# EasyEDA Pro project 按键点灯.eprj

# Schematic Schematic1
Board Name: Board1; Create Date: 2024-12-21; Page Name: P1; Project Name: 按键点灯; Schematic Name: Schematic1; Update Date: 2024-12-21; Company: 嘉立创EDA; Page Size: A4; Version: V1.0
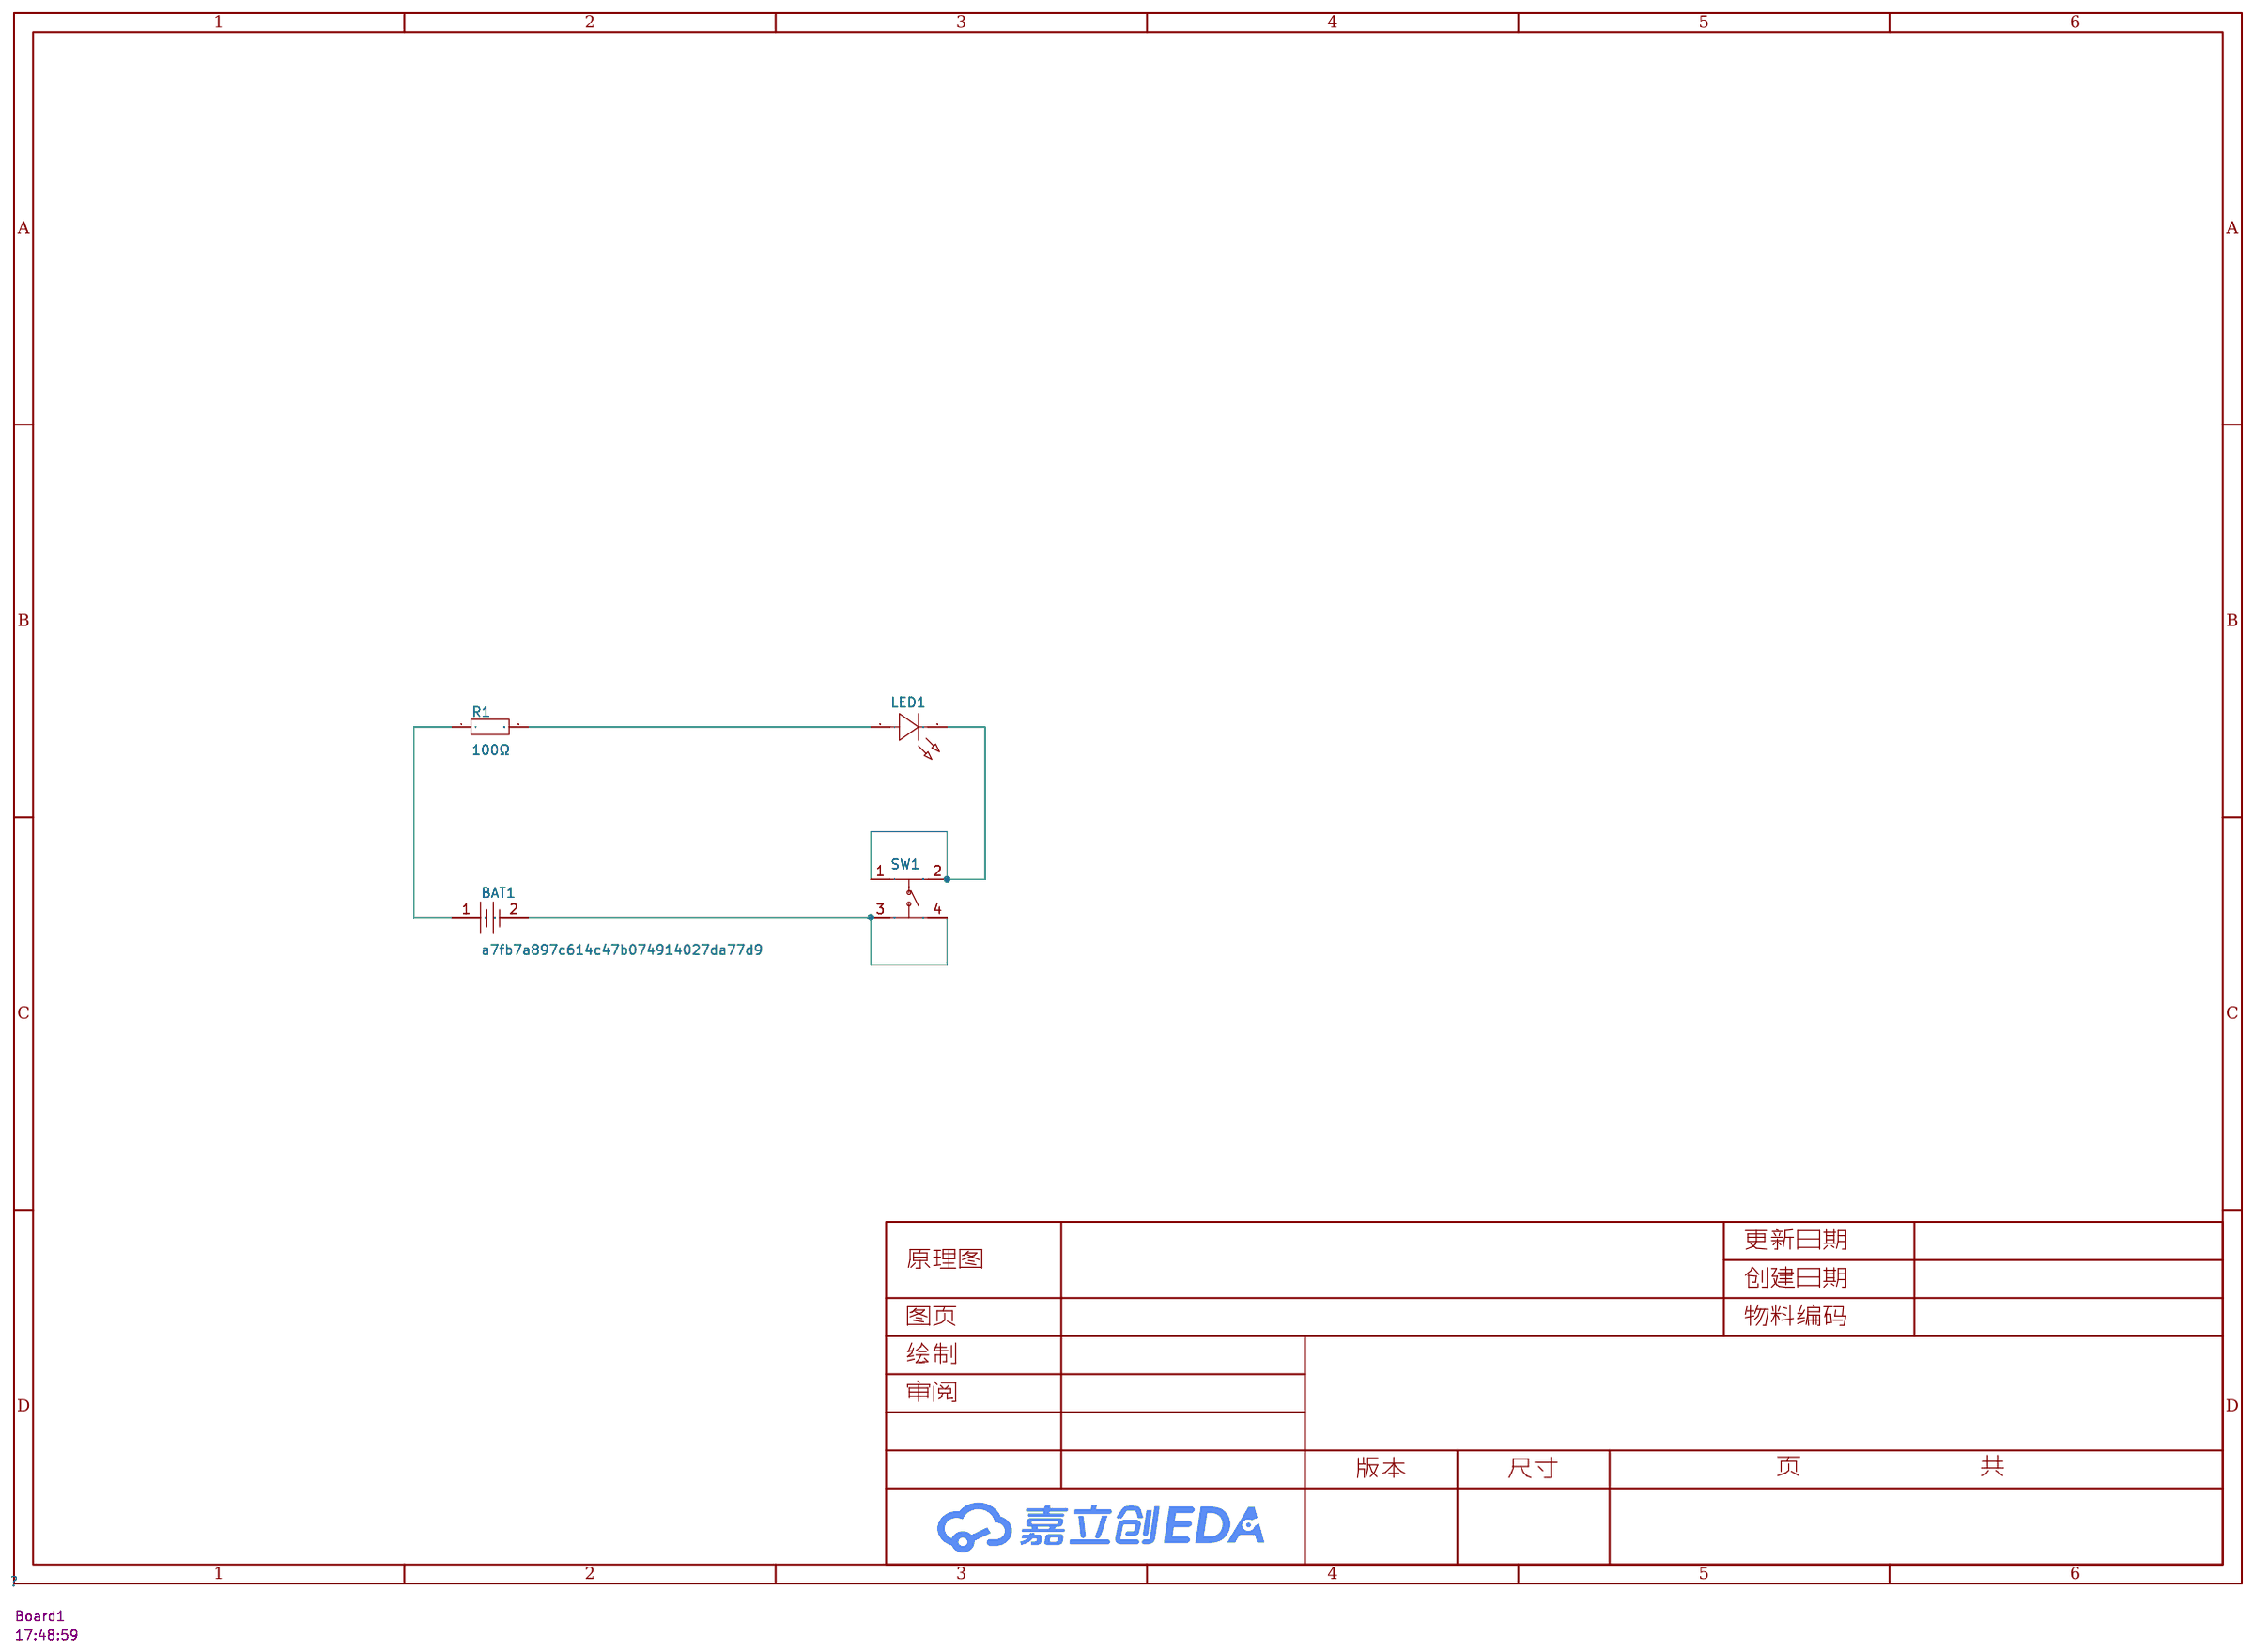
[diagram p0: schematic sheet]

## Parts
BAT1  a7fb7a897c614c47b074914027da77d9  [BAT-TH_KH-CR2032-2-1]
LED1  264-10SURD/S530-A3  [LED-TH_BD3.2-P2.54-RD]
R1  100Ω  [RES-TH_BD2.2-L6.5-P10.50-D0.6]
SW1  KH-6X6X5H-STM  [SW-SMD_4P-L6.0-W6.0-P4.50-LS9.0-2]

## Library data of the parts
BAT1 = KH-CR2032-2-1: Supplier Part: C5365915; Manufacturer: kinghelm(金航标); JLCPCB Part Class: 扩展库; Datasheet: https://atta.szlcsc.com/upload/public/pdf/source/20230301/F3ED62C53898C1F99BC47B7A2E148BA2.pdf; Supplier: LCSC
LED1 = 264-10SURD/S530-A3: Supplier Part: C2936518; Manufacturer: EVERLIGHT(亿光); Supplier Footprint: 插件,D=3mm; JLCPCB Part Class: 扩展库; Datasheet: https://atta.szlcsc.com/upload/public/pdf/source/20240320/16A3005EF69616026F8B48FE5D074EEA.pdf; Supplier: LCSC; Emitted Color: 红色; Forward Voltage (VF): 2V; Forward Current: 20mA; Dominant Wavelength: 624nm; Peak Wavelength: 632nm; Lens Color: 红色透镜; Luminous Intensity: 125mcd; Viewing Angle: 60°
R1 = MFR0W4F1000A50: LCSC Part Name: 100Ω ±1% 250mW 金属膜电阻; Supplier Part: C57438; Manufacturer: UNI-ROYAL(厚声); Supplier Footprint: 插件,D2.2xL6.5mm; JLCPCB Part Class: 扩展库; Datasheet: https://atta.szlcsc.com/upload/public/pdf/source/20191012/C436293_8820AA14BC71FA35E551C06C441482A0.pdf; Supplier: LCSC; Type: 金属膜电阻; Tolerance: ±1%; Overload Voltage (Max): 250V; Power(Watts): 250mW; Temperature Coefficient: ±50ppm/℃
SW1 = KH-6X6X5H-STM: LCSC Part Name: 6*6*5mm 立贴 轻触开关; Supplier Part: C2837531; Manufacturer: kinghelm(金航标); Supplier Footprint: SMD; JLCPCB Part Class: 扩展库; Datasheet: https://atta.szlcsc.com/upload/public/pdf/source/20210608/C2837531_45E87AB996CE723B09405FF2EA209C4C.pdf; Supplier: LCSC; Circuit: 单刀单掷; Actuator Style: 圆形按钮; Mounting Style: 立贴; Switch Length: 6mm; Switch Width: 6mm; Switch Height: 5mm; Strike Gundam: 不带; Contact Current: 50mA; Voltage Rating (DC): 12V; Actuator/Cap Color: 黑色; Pin Style: 鸥翼型; Mechanical Life: 8万次

## Nets
$1N345: BAT1.1 R1.1
$1N354: LED1.2(A) R1.2
$1N358: LED1.1(K) SW1.1 SW1.2
$1N364: BAT1.2 SW1.3 SW1.4

# Board PCB1
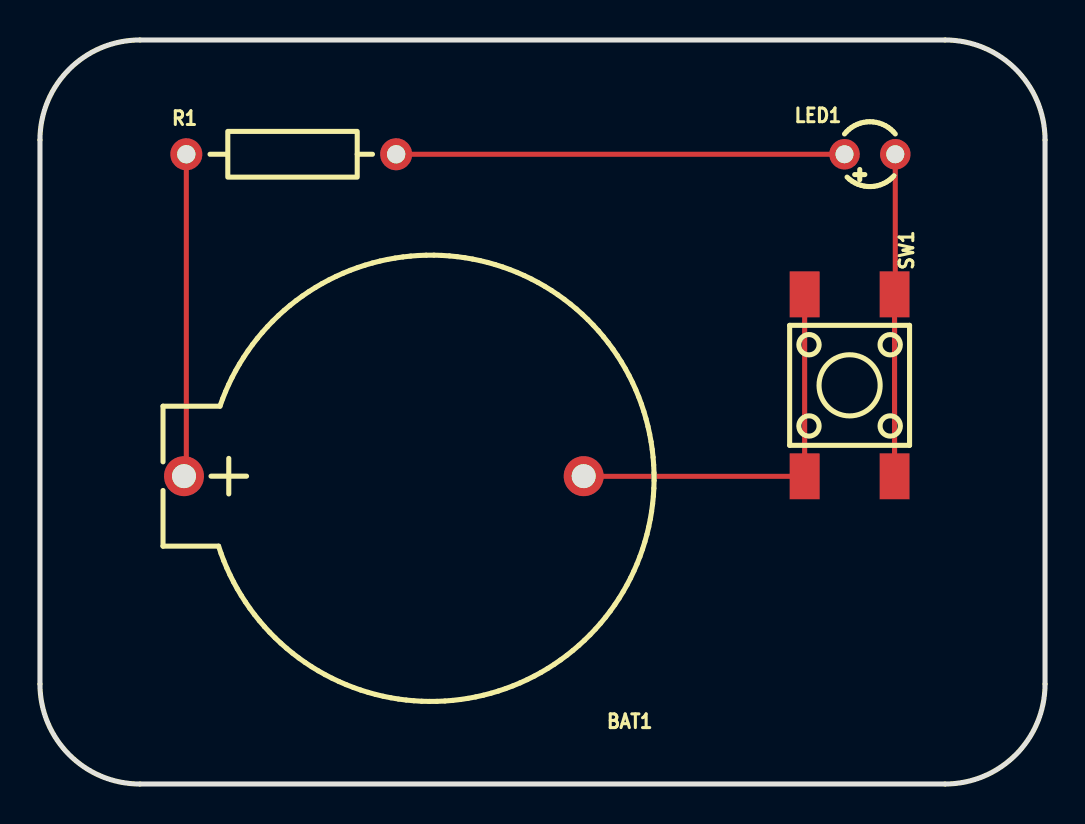
[diagram p1: board, top side]
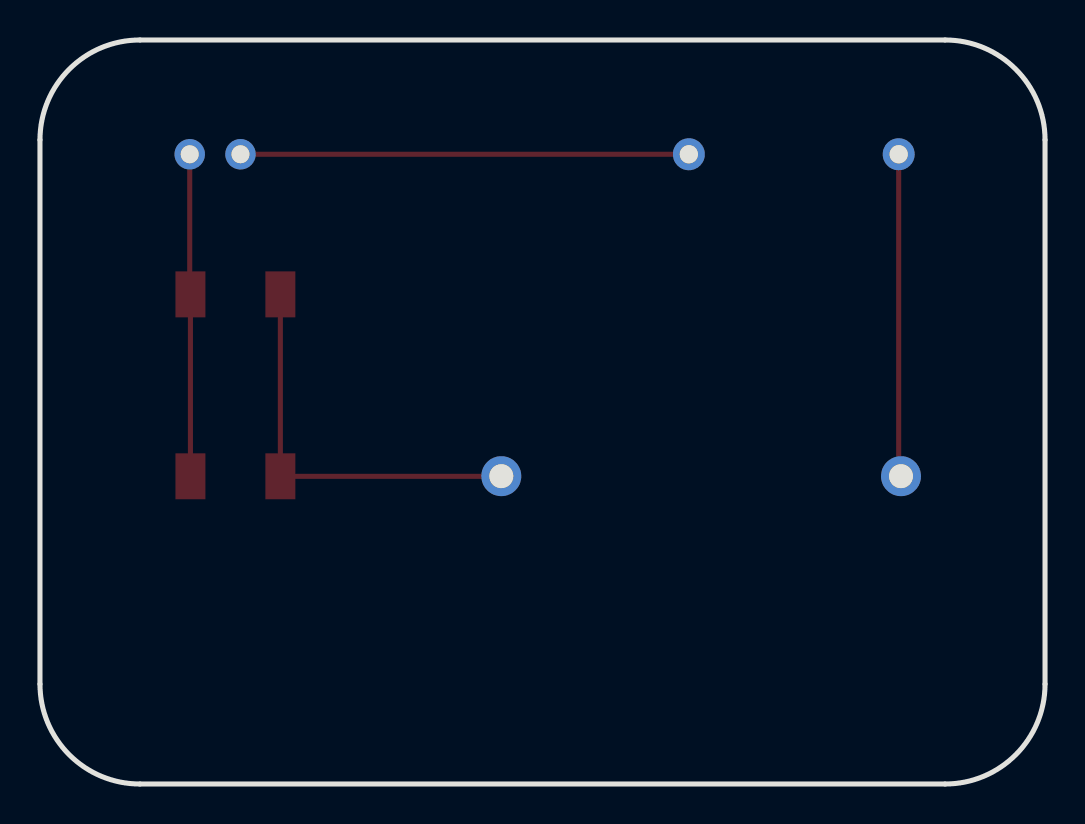
[diagram p2: board, bottom side, seen from below]

Outline 50.29 x 37.21 mm; copper layers: Top Layer, Bottom Layer. Coordinates in mm from the lower left corner of the outline.
Outline path: 0,32.21 0,5 arc(1.46,1.46) 5,0 45.29,0 arc(48.83,1.46) 50.29,5 50.29,32.21 arc(48.83,35.75) 45.29,37.21 5,37.21 arc(1.46,35.75) 0,32.21
Stack: Top Layer 0.035mm / Dielectric1 1.51mm FR4 er 4.5 / Bottom Layer 0.035mm

## Design rules (mm)
template: JLCPCB Capability(Two Layers Board)
spacing copperThickness1oz (default): track to track 0.102, other pairs 0.152 to 0.3
spacing copperThickness2oz: track to track 0.203, other pairs 0.152 to 0.3
track width copperThickness1oz (default): min 0.127, default 0.254, max 2.54
track width copperThickness2oz: min 0.203, default 0.254, max 2.54
differential pair differentialPair (default): width min 0.127, default 0.254, max 2.54; gap min 0.152, default 0.152
via viaSize (default): diameter min 0.5, default 0.61, max 10; hole min 0.3, default 0.305, max 6.3

## Placement (name value [footprint] x y rotation side)
BAT1  a7fb7a897c614c47b074914027da77d9  [BAT-TH_KH-CR2032-2-1]  17.21 15.4 180 top
LED1  264-10SURD/S530-A3  [LED-TH_BD3.2-P2.54-RD]  41.53 31.5 180 top
R1  100Ω  [RES-TH_BD2.2-L6.5-P10.50-D0.6]  12.57 31.5 0 top
SW1  KH-6X6X5H-STM  [SW-SMD_4P-L6.0-W6.0-P4.50-LS9.0-2]  40.51 19.94 270 top

## Footprints (pads in the part's own frame, mm; a bottom-side part is the same pattern mirrored in y, then rotated)
BAT-TH_KH-CR2032-2-1
  round 2 hole 1.2: 1(10,0) 2(-10,0)
LED-TH_BD3.2-P2.54-RD
  round 1.524 hole 0.9: 1(-1.27,0) 2(1.27,0)
RES-TH_BD2.2-L6.5-P10.50-D0.6
  round 1.6 hole 0.914: 1(-5.25,0) 2(5.25,0)
SW-SMD_4P-L6.0-W6.0-P4.50-LS9.0-2
  rect 2.3x1.5 smd: 1(-4.55,2.25) 2(4.55,2.25) 3(-4.55,-2.25) 4(4.55,-2.25)

## Nets
As in the schematic.

## Routing (per net, layer and track width the routed paths; a pad name or vN(x,y) marks a point on that pad's centre or on a via; arc(x,y) is an arc through that point)
$1N345: length 16.1
  Top Layer w0.254: BAT1.1 7.32,15.51 R1.1
$1N354: length 22.4
  Top Layer w0.254: R1.2 LED1.2
$1N358: length 16.1
  Top Layer w0.254: LED1.1 42.8,24.52 SW1.1 SW1.2
$1N364: length 20.2
  Top Layer w0.254: BAT1.2 27.21,15.39 SW1.4 SW1.3
